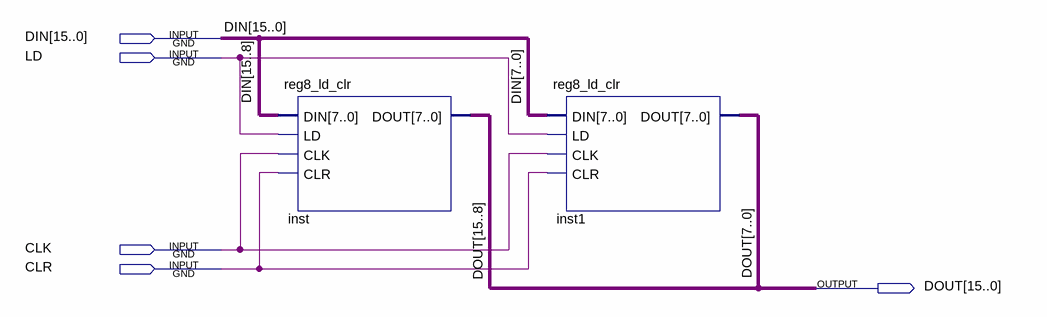
[diagram p0: schematic sheet]
// Quartus schematic reg16_ld_clr.bdf as structural Verilog: 2 symbols, 5 pins
module reg16_ld_clr (
  input  [15:0] DIN,
  input  LD,
  input  CLK,
  input  CLR,
  output [15:0] DOUT
);

  reg8_ld_clr inst (.DIN(DIN[15:8]), .LD(LD), .CLK(CLK), .CLR(CLR), .DOUT(DOUT[15:8]));
  reg8_ld_clr inst1 (.DIN(DIN[7:0]), .LD(LD), .CLK(CLK), .CLR(CLR), .DOUT(DOUT[7:0]));
endmodule
